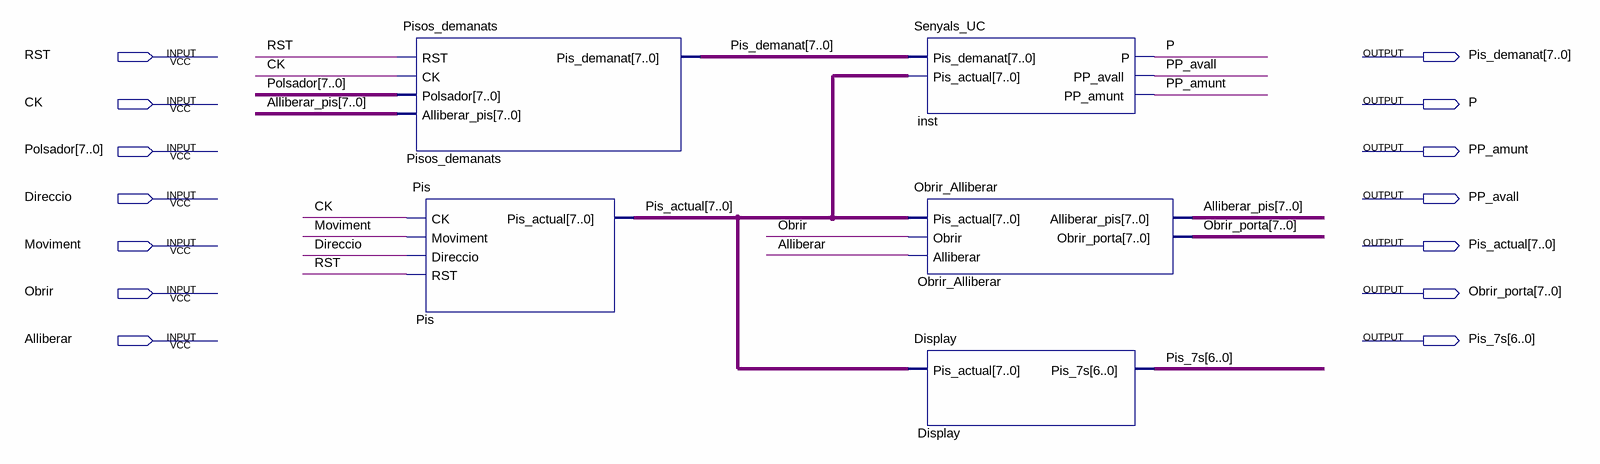
[diagram p0: schematic sheet]
// Quartus schematic UP.bdf as structural Verilog: 5 symbols, 14 pins
module UP (
  input  RST,
  input  CK,
  input  [7:0] Polsador,
  input  Direccio,
  input  Moviment,
  input  Obrir,
  input  Alliberar,
  output [7:0] Pis_demanat,
  output P,
  output PP_amunt,
  output PP_avall,
  output [7:0] Pis_actual,
  output [7:0] Obrir_porta,
  output [6:0] Pis_7s
);

  wire [7:0] Alliberar_pis;

  Pisos_demanats Pisos_demanats (
    .RST(RST), .CK(CK), .Polsador(Polsador), .Alliberar_pis(Alliberar_pis), .Pis_demanat(Pis_demanat));
  Pis Pis (.CK(CK), .Moviment(Moviment), .Direccio(Direccio), .RST(RST), .Pis_actual(Pis_actual));
  Senyals_UC inst (.Pis_demanat(Pis_demanat), .Pis_actual(Pis_actual), .P(P), .PP_avall(PP_avall), .PP_amunt(PP_amunt));
  Obrir_Alliberar Obrir_Alliberar (
    .Pis_actual(Pis_actual), .Obrir(Obrir), .Alliberar(Alliberar), .Alliberar_pis(Alliberar_pis),
    .Obrir_porta(Obrir_porta));
  Display Display (.Pis_actual(Pis_actual), .Pis_7s(Pis_7s));
endmodule
